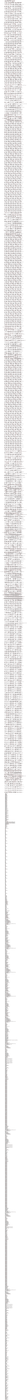
[diagram p0: schematic 1969.asc, whole sheet]
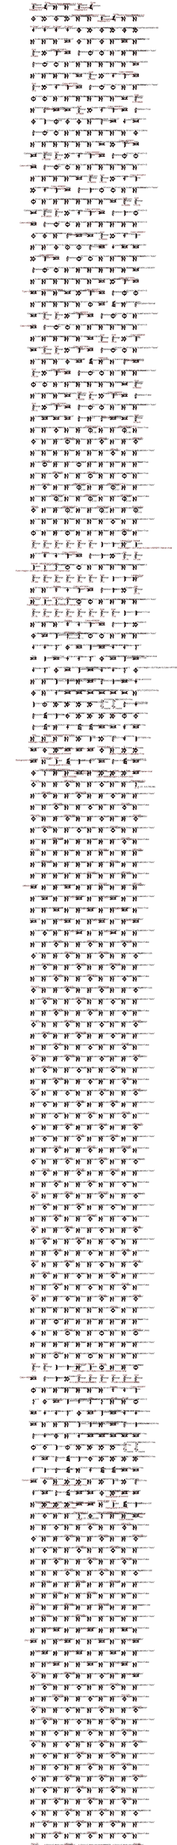
[diagram p1: schematic 1969.asc, part, row 1 of 5, column 1 of 1]
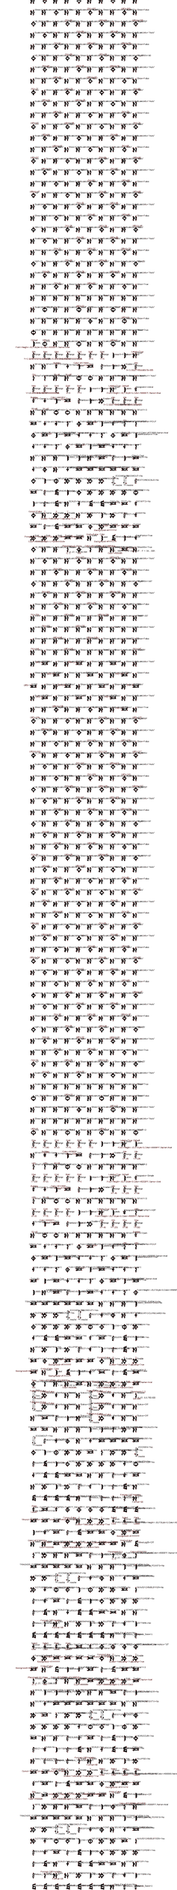
[diagram p2: schematic 1969.asc, part, row 2 of 5, column 1 of 1]
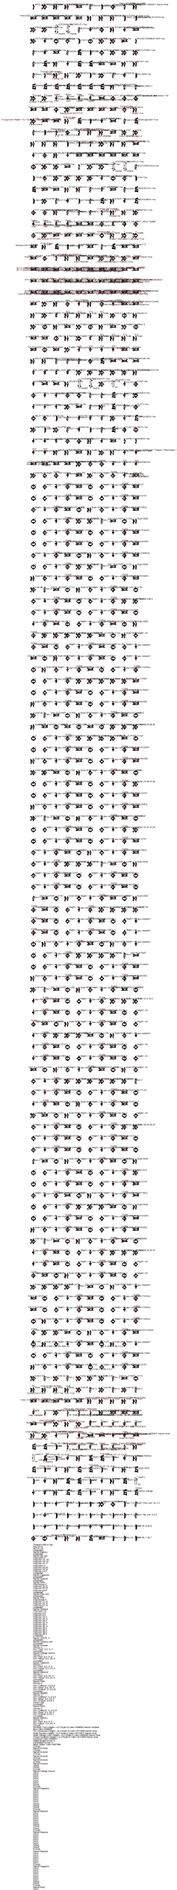
[diagram p3: schematic 1969.asc, part, row 3 of 5, column 1 of 1]
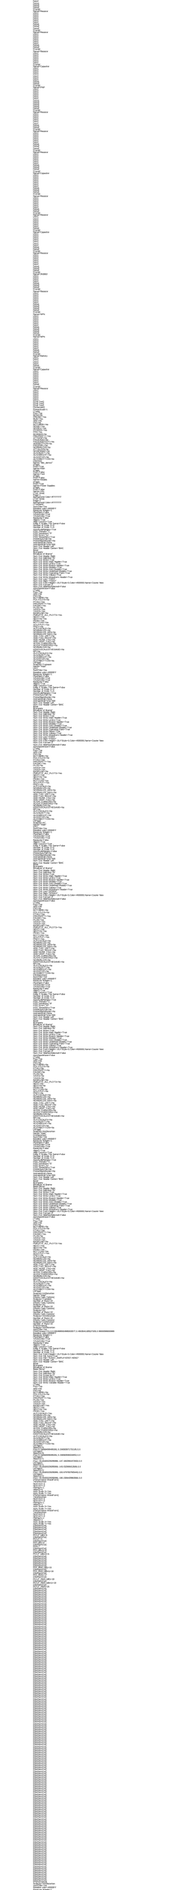
[diagram p4: schematic 1969.asc, part, row 4 of 5, column 1 of 1]
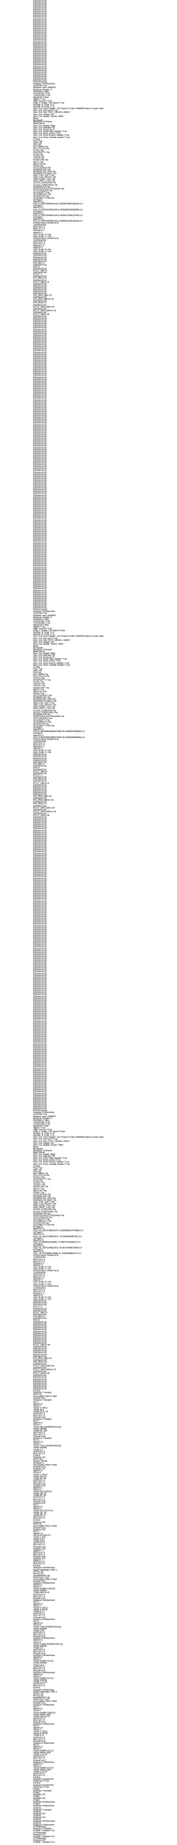
[diagram p5: schematic 1969.asc, part, row 5 of 5, column 1 of 1]
* 1969.asc
FileType=CIR 0 0
Version=10.01 0 0
Component Version=10.00 0
Shape Version=10.01 0 0 0
Screen=1920,1080 0 0 0 0
MCAPVersion=10.0.4.0 0 0 0 0
TXCnt=3 0 0 0 0
Line=0,0,22,0 0 0
Line=22,-3,22,3 0 0
Line=26,-7,26,7 0 0
Line=26,0,48,0 0 0
Current=32,8,16,8 0 0
Line=0,0,13,0 0 0
Rectangle=13,-12,15,12 0 0
Current=32,-24,32,-16 0 0
Current=32,24,32,16 0 0
Current=0,-8,8,-8 0 0
Line=0,0,22,0 0 0
Line=22,-8,22,8 0 0
Line=26,-8,26,8 0 0
Line=26,0,48,0 0 0
Current=32,12,16,12 0 0
Line=0,0,12,0 0 0
Line=12,-8,12,8 0 0
Line=18,-4,18,4 0 0
Line=24,0,24,0 0 0
Root="Bjt.root",0,0,0 0 0
Line=-2,0,2,0 0 0
Line=0,-2,0,2 0 0
Root="Bjt.root",0,0,0 0 0
Line=16,-4,14,-2 0 0
Line=16,4,14,2 0 0
Current=32,8,16,8 0 0
Root="Vsource.root",0,0,0 0 0
Line=0,0,12,0 0 0
Line=36,0,48,0 0 0
Ellipse=12,-12,36,12 0 0 0 0
FColor=None 0 0
Line=7,5,7,9 0 0
Root="Plus.root",41,7,0 0 0
Current=32,16,16,16 0 0
Definition=Ground 0 0
Shape=Ground 0 0 0 0
Mask=1793 0 0 0 0
memo=Ground 0 0 0 0
Label Offset=0,0,0,0 0
Definition=VSpice 0 0
Shape=SPICE_V 0 0 0 0
Mask=4864 0 0 0 0
memo=Voltage Source 0 0 0
Label Offset=19,13,15,13 0
Definition=Capacitor 0 0
Shape=Capacitor 0 0 0 0
Mask=6913 0 0 0 0
memo=Capacitor 0 0 0 0
Label Offset=16,12,12,12 0
Definition=Resistor 0 0
Shape=Resistor 0 0 0 0
Mask=7169 0 0 0 0
* Used=1: urc (symbol urc not available, pin order unknown); nets seen at it: 0
memo=Resistor 0 0 0 0
Label Offset=18,6,8,11 0
Definition=PNP 0 0
Shape=PNP 0 0 0 0
Mask=4609 0 0 0 0
memo=PNP Transistor 0 0 0
Label Offset=37,-13,-8,35 0
Definition=NPN 0 0
Shape=NPN 0 0 0 0
Mask=4224 0 0 0 0
* Used=3: urc (symbol urc not available, pin order unknown); nets seen at it: 0
memo=NPN High Voltage Transistor Transistor Ic=3.5A Pd=100W
Label Offset=29,-11,-6,26 0
Definition=NPN 0 0
Shape=NPN 0 0 0 0
Mask=4097 0 0 0 0
memo=NPN Transistor 0 0 0
Label Offset=37,-17,-14,33 0
Definition=Battery 0 0
Shape=Battery 0 0 0 0
Mask=4865 0 0 0 0
memo=Battery 0 0 0 0
Label Offset=19,7,10,13 0
Window Placement=2,3, -1,-1, -8,-30, 0,0,816,486
Default Object=Color=#000080 0
Default Object Font=Height=-15,FStyle=0,Color=#000080,Name=Arial
Default Object Apply Border To Text=No
Default Object Apply Fill To Text=No
WinBackGround Color=#FFFFFF 0
Select Color=#FF0000 0 0 0
Select Box Color=#000080 0 0
Grid Text Color=Height=-12,FStyle=0,Color=#FF0000,Name=Verdana 0 0
Component Color=#0000FF 0
Wire Color=#008000 0
Dynamic AC Voltage Color=#E4E4E4
Text Banner 0 Text=Height=-15,FStyle=0,Color=#800000,Name=Arial 0
Title Block 0 Background=#C0C0C0 0
Current=Height=-11,FStyle=0,Color=#0000FF,Name=Arial 0 0
Digital Path Color=#FF0000
Title Block=Height=-15,FStyle=0,Color=#000000,Name=Arial 0 0 0
Title Block 0 Border=#000000 0
Disabled Color=#C0C0C0 0
Error Color=#FF0000 0 0 0
Search Color=#FFFF00 0 0 0
Grid Color=#000000 0 0 0
Digital 0 Color=#000000
Digital R Color=#FFFF00
Digital F Color=#FFFF00
Digital 1 Color=#FF0000
Digital X Color=#C0C0C0
Digital Z Color=#808080
WarningFormat=3 0 0
GridTextFormulaFormat=3 0 0 0 0
Window Placement in AC Analysis=2,3, -1,-1, -8,-30, 75,75,1711,638
Window Placement in HmDistortion Analysis=1,2, 160,930, -4,-27, 793,465,1586,930
Window Placement in ImDistortion Analysis=1,2, 0,952, -4,-27, 0,0,816,486
SpiceType=AMBIGUOUS 0 0 0 0
TitleBlock Field_1=$name 0 0 0
TitleBlock Field_2=$user 0 $company 0
TitleBlock Field_3 0 0 0
TitleBlock Field_4=$date 0 0 0
TitleBlock Field_5=Page of $page $maxpage
TitleBlock One 0 Title=False 0
Title_Block_Border=False 0 0 0 0
Title_Block=False 0 0 0 0
Show Nodes=False 0 0 0
Show Voltages=False 0 0 0
Show Current=False 0 0 0
Show Power=False 0 0 0
Show Condition=False 0 0 0
Show Pin Connections=False 0 0
Show Cross=False 0 0 0
Show Attribute Text=True 0 0
Show Grid Text=True 0 0
Grid=26,11 0 0 0 0
Rot=1 0 0
Grid=86,12 0 0 0 0
Rot=1 0 0
Grid=90,57 0 0 0 0
Rot=1 0 0
Grid=2,54 0 0 0 0
Rot=1 0 0
Grid=31,68 0 0 0 0
Rot=1 0 0
Grids=2,42,7,42 0 0 0 0
Grids=2,42,2,44 0 0 0 0
Grid=2,50 0 0 0 0
Rot=3 0 0
ON=17,-4,PART 0 0 0 0
V=V1 0 0
Style=8192 0 0 0 0
Height=-16 0 0
Color=#0000FF 0 0
Font=Century Gothic 0
ON=-16,-41,VALUE 0 0 0 0
V=DC 0 AC 1 0 Sin 0 1 20k 0 0 0
Height=-16 0 0
Color=#0000FF 0 0
Font=Century Gothic 0
ON=0,22,COST 0 0 0 0
V 0 0
Height=-16 0 0
Color=#0000FF 0 0
Font=Century Gothic 0
ON=0,33,POWER 0 0 0 0
V 0 0
Height=-16 0 0
Color=#0000FF 0 0
Font=Century Gothic 0
ON=0,0,Saved_Pulse 0 0 0 0
V=DC 0 AC 1 0 Pulse 0 5 100n 10n 10n 400n 1u
Style=256 0 0 0 0
Height=-16 0 0
Color=#0000FF 0 0
Font=Century Gothic 0
ON=0,0,Saved_Sin 0 0 0 0
V=DC 0 AC 1 0 Sin 0 1 20k 0 0 0
Style=256 0 0 0 0
Height=-16 0 0
Color=#0000FF 0 0
Font=Century Gothic 0
Grids=2,50,2,54 0 0 0 0
Grid=7,42 0 0 0 0
ON=17,-34,PART 0 0 0 0
V=C1 0 0
Style=8192 0 0 0 0
Height=-16 0 0
Color=#0000FF 0 0
Font=Century Gothic 0
ON=10,12,CAPACITANCE 0 0 0 0
V=500n 0 0
Style=8192 0 0 0 0
Height=-16 0 0
Color=#0000FF 0 0
Font=Century Gothic 0
ON=0,22,CHARGE 0 0 0 0
V 0 0
Height=-16 0 0
Color=#0000FF 0 0
Font=Century Gothic 0
ON=0,33,FREQ 0 0 0 0
V 0 0
Height=-16 0 0
Color=#0000FF 0 0
Font=Century Gothic 0
ON=0,44,MODEL 0 0 0 0
V 0 0
Height=-16 0 0
Color=#0000FF 0 0
Font=Century Gothic 0
ON=0,55,COST 0 0 0 0
V 0 0
Height=-16 0 0
Color=#0000FF 0 0
Font=Century Gothic 0
ON=0,66,POWER 0 0 0 0
V 0 0
Height=-16 0 0
Color=#0000FF 0 0
Font=Century Gothic 0
Grids=13,42,18,42 0 0 0 0
Grids=18,5,18,20 0 0 0 0
Grids=18,5,26,5 0 0 0 0
Grid=18,20 0 0 0 0
Rot=7 0 0
ON=10,6,PART 0 0 0 0
V=R1 0 0
Style=8192 0 0 0 0
Height=-16 0 0
Color=#0000FF 0 0
Font=Century Gothic 0
ON=10,24,RESISTANCE 0 0 0 0
V=100K 0 0
Style=8192 0 0 0 0
Height=-16 0 0
Color=#0000FF 0 0
Font=Century Gothic 0
ON=0,22,FREQ 0 0 0 0
V 0 0
Height=-16 0 0
Color=#0000FF 0 0
Font=Century Gothic 0
ON=0,33,MODEL 0 0 0 0
V 0 0
Height=-16 0 0
Color=#0000FF 0 0
Font=Century Gothic 0
ON=0,44,COST 0 0 0 0
V 0 0
Height=-16 0 0
Color=#0000FF 0 0
Font=Century Gothic 0
ON=0,55,POWER 0 0 0 0
V 0 0
Height=-16 0 0
Color=#0000FF 0 0
Font=Century Gothic 0
Grids=18,26,18,42 0 0 0 0
Grids=18,42,18,54 0 0 0 0
Grids=18,42,20,42 0 0 0 0
Grid=18,54 0 0 0 0
Rot=7 0 0
ON=10,6,PART 0 0 0 0
V=R2 0 0
Style=8192 0 0 0 0
Height=-16 0 0
Color=#0000FF 0 0
Font=Century Gothic 0
ON=10,24,RESISTANCE 0 0 0 0
V=120000 0 0
Style=8192 0 0 0 0
Height=-16 0 0
Color=#0000FF 0 0
Font=Century Gothic 0
ON=0,22,FREQ 0 0 0 0
V 0 0
Height=-16 0 0
Color=#0000FF 0 0
Font=Century Gothic 0
ON=0,33,MODEL 0 0 0 0
V 0 0
Height=-16 0 0
Color=#0000FF 0 0
Font=Century Gothic 0
ON=0,44,COST 0 0 0 0
V 0 0
Height=-16 0 0
Color=#0000FF 0 0
Font=Century Gothic 0
ON=0,55,POWER 0 0 0 0
V 0 0
Height=-16 0 0
Color=#0000FF 0 0
Font=Century Gothic 0
Grids=18,60,18,68 0 0 0 0
Grids=18,68,31,68 0 0 0 0
Grid=20,42 0 0 0 0
ON=16,-29,PART 0 0 0 0
V=R3 0 0
Style=8192 0 0 0 0
Height=-16 0 0
Color=#0000FF 0 0
Font=Century Gothic 0
ON=16,10,RESISTANCE 0 0 0 0
V=2K2 0 0
Style=8192 0 0 0 0
Height=-16 0 0
Color=#0000FF 0 0
Font=Century Gothic 0
ON=16,22,FREQ 0 0 0 0
V 0 0
Height=-16 0 0
Color=#0000FF 0 0
Font=Century Gothic 0
ON=16,33,MODEL 0 0 0 0
V 0 0
Height=-16 0 0
Color=#0000FF 0 0
Font=Century Gothic 0
ON=16,44,COST 0 0 0 0
V 0 0
Height=-16 0 0
Color=#0000FF 0 0
Font=Century Gothic 0
ON=16,55,POWER 0 0 0 0
V 0 0
Height=-16 0 0
Color=#0000FF 0 0
Font=Century Gothic 0
Grid=26,5 0 0 0 0
Rot=1 0 0
ON=16,8,PART 0 0 0 0
V=C2 0 0
Style=8192 0 0 0 0
Height=-16 0 0
Color=#0000FF 0 0
Font=Century Gothic 0
ON=16,28,CAPACITANCE 0 0 0 0
V=100uF 0 0
Style=8192 0 0 0 0
Height=-16 0 0
Color=#0000FF 0 0
Font=Century Gothic 0
ON=16,22,CHARGE 0 0 0 0
V 0 0
Height=-16 0 0
Color=#0000FF 0 0
Font=Century Gothic 0
ON=16,33,FREQ 0 0 0 0
V 0 0
Height=-16 0 0
Color=#0000FF 0 0
Font=Century Gothic 0
ON=16,44,MODEL 0 0 0 0
V 0 0
Height=-16 0 0
Color=#0000FF 0 0
Font=Century Gothic 0
ON=16,55,COST 0 0 0 0
V 0 0
Height=-16 0 0
Color=#0000FF 0 0
Font=Century Gothic 0
ON=16,66,POWER 0 0 0 0
V 0 0
Height=-16 0 0
Color=#0000FF 0 0
Font=Century Gothic 0
Grids=26,5,34,5 0 0 0 0
Grids=26,42,28,42 0 0 0 0
Grid=28,42 0 0 0 0
ON=35,-21,PART 0 0 0 0
V=Q1 0 0
Style=8192 0 0 0 0
Height=-16 0 0
Color=#0000FF 0 0
Font=Century Gothic 0
ON=0,11,VALUE 0 0 0 0
V 0 0
Height=-16 0 0
Color=#0000FF 0 0
Font=Century Gothic 0
ON=28,1,MODEL 0 0 0 0
V=2N3906 0 0
Style=8192 0 0 0 0
Height=-16 0 0
Color=#0000FF 0 0
Font=Century Gothic 0
ON=0,33,COST 0 0 0 0
V 0 0
Height=-16 0 0
Color=#0000FF 0 0
Font=Century Gothic 0
ON=0,44,POWER 0 0 0 0
V 0 0
Height=-16 0 0
Color=#0000FF 0 0
Font=Century Gothic 0
ON=28,29,PACKAGE 0 0 0 0
V=TO-92 0 0
Height=-16 0 0
Color=#0000FF 0 0
Font=Century Gothic 0
Grids=31,37,31,39 0 0 0 0
Grids=31,37,47,37 0 0 0 0
Grids=31,45,31,48 0 0 0 0
Grids=31,48,63,48 0 0 0 0
Grids=31,48,31,54 0 0 0 0
Grid=31,54 0 0 0 0
Rot=7 0 0
ON=10,6,PART 0 0 0 0
V=R4 0 0
Style=8192 0 0 0 0
Height=-16 0 0
Color=#0000FF 0 0
Font=Century Gothic 0
ON=10,24,RESISTANCE 0 0 0 0
V=8K2 0 0
Style=8192 0 0 0 0
Height=-16 0 0
Color=#0000FF 0 0
Font=Century Gothic 0
ON=0,22,FREQ 0 0 0 0
V 0 0
Height=-16 0 0
Color=#0000FF 0 0
Font=Century Gothic 0
ON=0,33,MODEL 0 0 0 0
V 0 0
Height=-16 0 0
Color=#0000FF 0 0
Font=Century Gothic 0
ON=0,44,COST 0 0 0 0
V 0 0
Height=-16 0 0
Color=#0000FF 0 0
Font=Century Gothic 0
ON=0,55,POWER 0 0 0 0
V 0 0
Height=-16 0 0
Color=#0000FF 0 0
Font=Century Gothic 0
Grids=31,60,31,68 0 0 0 0
Grids=31,68,47,68 0 0 0 0
Grid=34,5 0 0 0 0
ON=16,-29,PART 0 0 0 0
V=R5 0 0
Style=8192 0 0 0 0
Height=-16 0 0
Color=#0000FF 0 0
Font=Century Gothic 0
ON=16,10,RESISTANCE 0 0 0 0
V=39K 0 0
Style=8192 0 0 0 0
Height=-16 0 0
Color=#0000FF 0 0
Font=Century Gothic 0
ON=16,22,FREQ 0 0 0 0
V 0 0
Height=-16 0 0
Color=#0000FF 0 0
Font=Century Gothic 0
ON=16,33,MODEL 0 0 0 0
V 0 0
Height=-16 0 0
Color=#0000FF 0 0
Font=Century Gothic 0
ON=16,44,COST 0 0 0 0
V 0 0
Height=-16 0 0
Color=#0000FF 0 0
Font=Century Gothic 0
ON=16,55,POWER 0 0 0 0
V 0 0
Height=-16 0 0
Color=#0000FF 0 0
Font=Century Gothic 0
Grids=40,5,47,5 0 0 0 0
Grids=47,5,47,9 0 0 0 0
Grids=47,5,76,5 0 0 0 0
Grid=47,9 0 0 0 0
Rot=7 0 0
ON=10,6,PART 0 0 0 0
V=R6 0 0
Style=8192 0 0 0 0
Height=-16 0 0
Color=#0000FF 0 0
Font=Century Gothic 0
ON=10,24,RESISTANCE 0 0 0 0
V=150 0 0
Style=8192 0 0 0 0
Height=-16 0 0
Color=#0000FF 0 0
Font=Century Gothic 0
ON=0,22,FREQ 0 0 0 0
V 0 0
Height=-16 0 0
Color=#0000FF 0 0
Font=Century Gothic 0
ON=0,33,MODEL 0 0 0 0
V 0 0
Height=-16 0 0
Color=#0000FF 0 0
Font=Century Gothic 0
ON=0,44,COST 0 0 0 0
V 0 0
Height=-16 0 0
Color=#0000FF 0 0
Font=Century Gothic 0
ON=0,55,POWER 0 0 0 0
V 0 0
Height=-16 0 0
Color=#0000FF 0 0
Font=Century Gothic 0
Grids=47,15,47,17 0 0 0 0
Grids=47,17,53,17 0 0 0 0
Grids=47,17,47,18 0 0 0 0
Grid=47,18 0 0 0 0
Rot=1 0 0
ON=16,8,PART 0 0 0 0
V=C3 0 0
Style=8192 0 0 0 0
Height=-16 0 0
Color=#0000FF 0 0
Font=Century Gothic 0
ON=16,28,CAPACITANCE 0 0 0 0
V=220uF 0 0
Style=8192 0 0 0 0
Height=-16 0 0
Color=#0000FF 0 0
Font=Century Gothic 0
ON=16,22,CHARGE 0 0 0 0
V 0 0
Height=-16 0 0
Color=#0000FF 0 0
Font=Century Gothic 0
ON=16,33,FREQ 0 0 0 0
V 0 0
Height=-16 0 0
Color=#0000FF 0 0
Font=Century Gothic 0
ON=16,44,MODEL 0 0 0 0
V 0 0
Height=-16 0 0
Color=#0000FF 0 0
Font=Century Gothic 0
ON=16,55,COST 0 0 0 0
V 0 0
Height=-16 0 0
Color=#0000FF 0 0
Font=Century Gothic 0
ON=16,66,POWER 0 0 0 0
V 0 0
Height=-16 0 0
Color=#0000FF 0 0
Font=Century Gothic 0
Grids=47,24,47,27 0 0 0 0
Grids=47,27,76,27 0 0 0 0
Grids=47,27,47,28 0 0 0 0
Grid=47,28 0 0 0 0
Rot=7 0 0
ON=10,6,PART 0 0 0 0
V=R7 0 0
Style=8192 0 0 0 0
Height=-16 0 0
Color=#0000FF 0 0
Font=Century Gothic 0
ON=10,24,RESISTANCE 0 0 0 0
V=2K7 0 0
Style=8192 0 0 0 0
Height=-16 0 0
Color=#0000FF 0 0
Font=Century Gothic 0
ON=0,22,FREQ 0 0 0 0
V 0 0
Height=-16 0 0
Color=#0000FF 0 0
Font=Century Gothic 0
ON=0,33,MODEL 0 0 0 0
V 0 0
Height=-16 0 0
Color=#0000FF 0 0
Font=Century Gothic 0
ON=0,44,COST 0 0 0 0
V 0 0
Height=-16 0 0
Color=#0000FF 0 0
Font=Century Gothic 0
ON=0,55,POWER 0 0 0 0
V 0 0
Height=-16 0 0
Color=#0000FF 0 0
Font=Century Gothic 0
Grids=47,34,47,37 0 0 0 0
Grids=47,37,47,41 0 0 0 0
Grid=47,41 0 0 0 0
Rot=7 0 0
ON=10,6,PART 0 0 0 0
V=R8 0 0
Style=8192 0 0 0 0
Height=-16 0 0
Color=#0000FF 0 0
Font=Century Gothic 0
ON=10,24,RESISTANCE 0 0 0 0
V=220 0 0
Style=8192 0 0 0 0
Height=-16 0 0
Color=#0000FF 0 0
Font=Century Gothic 0
ON=0,22,FREQ 0 0 0 0
V 0 0
Height=-16 0 0
Color=#0000FF 0 0
Font=Century Gothic 0
ON=0,33,MODEL 0 0 0 0
V 0 0
Height=-16 0 0
Color=#0000FF 0 0
Font=Century Gothic 0
ON=0,44,COST 0 0 0 0
V 0 0
Height=-16 0 0
Color=#0000FF 0 0
Font=Century Gothic 0
ON=0,55,POWER 0 0 0 0
V 0 0
Height=-16 0 0
Color=#0000FF 0 0
Font=Century Gothic 0
Grids=47,47,47,54 0 0 0 0
Grid=47,54 0 0 0 0
Rot=1 0 0
ON=16,8,PART 0 0 0 0
V=C4 0 0
Style=8192 0 0 0 0
Height=-16 0 0
Color=#0000FF 0 0
Font=Century Gothic 0
ON=16,28,CAPACITANCE 0 0 0 0
V=220uF 0 0
Style=8192 0 0 0 0
Height=-16 0 0
Color=#0000FF 0 0
Font=Century Gothic 0
ON=16,22,CHARGE 0 0 0 0
V 0 0
Height=-16 0 0
Color=#0000FF 0 0
Font=Century Gothic 0
ON=16,33,FREQ 0 0 0 0
V 0 0
Height=-16 0 0
Color=#0000FF 0 0
Font=Century Gothic 0
ON=16,44,MODEL 0 0 0 0
V 0 0
Height=-16 0 0
Color=#0000FF 0 0
Font=Century Gothic 0
ON=16,55,COST 0 0 0 0
V 0 0
Height=-16 0 0
Color=#0000FF 0 0
Font=Century Gothic 0
ON=16,66,POWER 0 0 0 0
V 0 0
Height=-16 0 0
Color=#0000FF 0 0
Font=Century Gothic 0
Grids=47,60,47,68 0 0 0 0
Grids=47,68,66,68 0 0 0 0
Grid=53,17 0 0 0 0
ON=16,-29,PART 0 0 0 0
V=R9 0 0
Style=8192 0 0 0 0
Height=-16 0 0
Color=#0000FF 0 0
Font=Century Gothic 0
ON=16,10,RESISTANCE 0 0 0 0
V=1K 0 0
Style=8192 0 0 0 0
Height=-16 0 0
Color=#0000FF 0 0
Font=Century Gothic 0
ON=16,22,FREQ 0 0 0 0
V 0 0
Height=-16 0 0
Color=#0000FF 0 0
Font=Century Gothic 0
ON=16,33,MODEL 0 0 0 0
V 0 0
Height=-16 0 0
Color=#0000FF 0 0
Font=Century Gothic 0
ON=16,44,COST 0 0 0 0
V 0 0
Height=-16 0 0
Color=#0000FF 0 0
Font=Century Gothic 0
ON=16,55,POWER 0 0 0 0
V 0 0
Height=-16 0 0
Color=#0000FF 0 0
Font=Century Gothic 0
Grids=59,17,66,17 0 0 0 0
Grids=66,17,66,45 0 0 0 0
Grids=66,17,73,17 0 0 0 0
Grid=63,48 0 0 0 0
ON=29,-11,PART 0 0 0 0
V=Q2 0 0
Style=8192 0 0 0 0
ON=29,3,MODEL 0 0 0 0
V=2N3902 0 0
ON=29,17,POWER 0 0 0 0
V=100 0 0
ON=29,45,PACKAGE 0 0 0 0
V=TO-204AA 0 0
Grids=66,51,66,56 0 0 0 0
Grids=66,56,73,56 0 0 0 0
Grids=66,56,66,59 0 0 0 0
Grid=66,59 0 0 0 0
Rot=7 0 0
ON=10,6,PART 0 0 0 0
V=R10 0 0
Style=8192 0 0 0 0
Height=-16 0 0
Color=#0000FF 0 0
Font=Century Gothic 0
ON=10,24,RESISTANCE 0 0 0 0
V=2K2 0 0
Style=8192 0 0 0 0
Height=-16 0 0
Color=#0000FF 0 0
Font=Century Gothic 0
ON=0,22,FREQ 0 0 0 0
V 0 0
Height=-16 0 0
Color=#0000FF 0 0
Font=Century Gothic 0
ON=0,33,MODEL 0 0 0 0
V 0 0
Height=-16 0 0
Color=#0000FF 0 0
Font=Century Gothic 0
ON=0,44,COST 0 0 0 0
V 0 0
Height=-16 0 0
Color=#0000FF 0 0
Font=Century Gothic 0
ON=0,55,POWER 0 0 0 0
V 0 0
Height=-16 0 0
Color=#0000FF 0 0
Font=Century Gothic 0
Grids=66,65,66,68 0 0 0 0
Grids=66,68,76,68 0 0 0 0
Grids=76,5,76,14 0 0 0 0
Grids=76,5,86,5 0 0 0 0
Grid=73,17 0 0 0 0
ON=32,-17,PART 0 0 0 0
V=Q3 0 0
Style=8192 0 0 0 0
Height=-16 0 0
Color=#0000FF 0 0
Font=Century Gothic 0
ON=32,11,VALUE 0 0 0 0
V 0 0
Height=-16 0 0
Color=#0000FF 0 0
Font=Century Gothic 0
ON=32,1,MODEL 0 0 0 0
V=MJE480 0 0
Style=8192 0 0 0 0
Height=-16 0 0
Color=#0000FF 0 0
Font=Century Gothic 0
ON=32,33,COST 0 0 0 0
V 0 0
Height=-16 0 0
Color=#0000FF 0 0
Font=Century Gothic 0
ON=32,44,POWER 0 0 0 0
V 0 0
Height=-16 0 0
Color=#0000FF 0 0
Font=Century Gothic 0
ON=32,29,PACKAGE 0 0 0 0
V=TO-39 0 0
Height=-16 0 0
Color=#0000FF 0 0
Font=Century Gothic 0
Grids=76,20,76,27 0 0 0 0
Grids=76,27,76,41 0 0 0 0
Grids=76,41,90,41 0 0 0 0
Grids=76,41,76,53 0 0 0 0
Grid=73,56 0 0 0 0
ON=32,-17,PART 0 0 0 0
V=Q4 0 0
Style=8192 0 0 0 0
Height=-16 0 0
Color=#0000FF 0 0
Font=Century Gothic 0
ON=32,11,VALUE 0 0 0 0
V 0 0
Height=-16 0 0
Color=#0000FF 0 0
Font=Century Gothic 0
ON=32,1,MODEL 0 0 0 0
V=MJE480 0 0
Style=8192 0 0 0 0
Height=-16 0 0
Color=#0000FF 0 0
Font=Century Gothic 0
ON=32,33,COST 0 0 0 0
V 0 0
Height=-16 0 0
Color=#0000FF 0 0
Font=Century Gothic 0
ON=32,44,POWER 0 0 0 0
V 0 0
Height=-16 0 0
Color=#0000FF 0 0
Font=Century Gothic 0
ON=32,29,PACKAGE 0 0 0 0
V=TO-39 0 0
Height=-16 0 0
Color=#0000FF 0 0
Font=Century Gothic 0
Grids=76,59,76,68 0 0 0 0
Grids=86,5,86,6 0 0 0 0
Grid=86,12 0 0 0 0
Rot=3 0 0
ON=6,-48,PART 0 0 0 0
V=V2 0 0
Style=8192 0 0 0 0
Height=-16 0 0
Color=#0000FF 0 0
Font=Century Gothic 0
ON=9,-21,VALUE 0 0 0 0
V=50 0 0
Style=8192 0 0 0 0
Height=-16 0 0
Color=#0000FF 0 0
Font=Century Gothic 0
ON=0,22,COST 0 0 0 0
V 0 0
Height=-16 0 0
Color=#0000FF 0 0
Font=Century Gothic 0
ON=0,33,POWER 0 0 0 0
V 0 0
Height=-16 0 0
Color=#0000FF 0 0
Font=Century Gothic 0
Grids=90,41,90,42 0 0 0 0
Grid=90,42 0 0 0 0
Rot=7 0 0
ON=-38,8,PART 0 0 0 0
V=C5 0 0
Style=8192 0 0 0 0
Height=-16 0 0
Color=#0000FF 0 0
Font=Century Gothic 0
ON=-61,28,CAPACITANCE 0 0 0 0
V=2200uF 0 0
Style=8192 0 0 0 0
Height=-16 0 0
Color=#0000FF 0 0
Font=Century Gothic 0
ON=-16,22,CHARGE 0 0 0 0
V 0 0
Height=-16 0 0
Color=#0000FF 0 0
Font=Century Gothic 0
ON=-16,33,FREQ 0 0 0 0
V 0 0
Height=-16 0 0
Color=#0000FF 0 0
Font=Century Gothic 0
ON=-16,44,MODEL 0 0 0 0
V 0 0
Height=-16 0 0
Color=#0000FF 0 0
Font=Century Gothic 0
ON=-16,55,COST 0 0 0 0
V 0 0
Height=-16 0 0
Color=#0000FF 0 0
Font=Century Gothic 0
ON=-16,66,POWER 0 0 0 0
V 0 0
Height=-16 0 0
Color=#0000FF 0 0
Font=Century Gothic 0
Grids=90,48,90,51 0 0 0 0
Grid=90,51 0 0 0 0
Rot=7 0 0
ON=10,6,PART 0 0 0 0
V=R11 0 0
Style=8192 0 0 0 0
Height=-16 0 0
Color=#0000FF 0 0
Font=Century Gothic 0
ON=10,24,RESISTANCE 0 0 0 0
V=8 0 0
Style=8192 0 0 0 0
Height=-16 0 0
Color=#0000FF 0 0
Font=Century Gothic 0
ON=0,22,FREQ 0 0 0 0
V 0 0
Height=-16 0 0
Color=#0000FF 0 0
Font=Century Gothic 0
ON=0,33,MODEL 0 0 0 0
V 0 0
Height=-16 0 0
Color=#0000FF 0 0
Font=Century Gothic 0
ON=0,44,COST 0 0 0 0
V 0 0
Height=-16 0 0
Color=#0000FF 0 0
Font=Century Gothic 0
ON=0,55,POWER 0 0 0 0
V 0 0
Height=-16 0 0
Color=#0000FF 0 0
Font=Century Gothic 0
Text="OUT" 0 0 0 0
Grid=90,41 0 0 0 0
Height=-16 0 0
Font=Century Gothic 0
CBorder=None 0 0
Text="IN" 0 0 0 0
Grid=2,42 0 0 0 0
Height=-16 0 0
Font=Century Gothic 0
CBorder=None 0 0
Text="10 Watt A Class Power Amplifier circa 1965?"
Text="by John Hood" Linsley 0
Text=".13% THD 1KHz at and 10 watts"
Text="http://www.hilberink.nl/amps/amps.htm" 0 0 0 0
Text="http://www.tcaas.btinternet.co.uk/jlh1969.pdf" 0 0 0 0
Grid=79,37 0 0 0 0
Height=-16 0 0
Font=Century Gothic 0
CBorder=None 0 0
CurrentSection 0=0 0
CurrentSection 1=0 0
CurrentSection 2=0 0
CurrentSection 3=0 0
Splitter.xs=0 0 0 0 0
Splitter.ys=0 0 0 0 0
TextQuad=4099 0 0 0 0
Scale=1 0 0 0 0
GridUser=10 0 0 0 0
ShapeGroups="Main","Euro","DeMorgan","Polarity","Electrolytic","GroundArrow" 0 0 0 0
CalcRMS=False 0 0
CalcAVG=False 0 0
CalcPeak=False 0 0
CalcVoltage=True 0 0
DisplayMeasure=Last 0 0
FILESAVEASOLD=No 0 0
FILEPCB=No 0 0
SELECT=Yes 0 0 0 0
COMP=Yes 0 0
TEXT=Yes 0 0 0 0
WIRE=Yes 0 0
WIRED=Yes 0 0
GRAPHIC=Yes 0 0 0 0
LINE=No 0 0
ELLIPSE=No 0 0 0 0
RECT=No 0 0
DIAM=No 0 0
LEFTBRK=No 0 0
RIGHTBRK=No 0 0
META=No 0 0 0 0
FLAG=No 0 0
INFO=Yes 0 0
HELP=Yes 0 0
HELP_SPICE=No 0 0
LINK=No 0 0
REGION_ENABLE=Yes 0 0
DIGTRC=No 0 0
DIGTRC2=No 0 0
DIGALL=No 0 0
GRIDTEXT=Yes 0 0 0 0
COMPTEXT=Yes 0 0
MEASURED=Yes 0 0 0 0
CURRENT=Yes 0 0
CONDITIN=Yes 0 0
CROSS=No 0 0
GRID=No 0 0 0 0
TITLE=No 0 0 0 0
RUBBER=Yes 0 0
STEP=Yes 0 0 0 0
MIRROR=Yes 0 0 0 0
ROTATE=Yes 0 0
FLIPY=Yes 0 0
FLIPX=Yes 0 0
CIR_MAKEMACRO=No 0 0
CLEARCUTWIRE=No 0 0
FINDCOMP=Yes 0 0
FIND=Yes 0 0
REPEAT=No 0 0
REPLACE=No 0 0
MODEL=Yes 0 0 0 0
CIR2CKT=No 0 0
ENABLE=No 0 0 0 0
DISABLE=No 0 0
TOFRONT=No 0 0 0 0
TOBACK=No 0 0 0 0
SELNEXT=No 0 0 0 0
* ZOOMIN=Yes: mesfet (symbol mesfet not available, pin order unknown); nets seen at it: 0
* ZOOMOUT=Yes: mesfet (symbol mesfet not available, pin order unknown); nets seen at it: 0
GOTOFLAG=No 0 0 0 0
* UPLEVEL=Yes: urc (symbol urc not available, pin order unknown); nets seen at it: 0
COLOR=No 0 0
FONT=No 0 0
DM_LAST=No 0 0
DM_RMS=No 0 0
DM_AVG=No 0 0
DM_PEAK=No 0 0
GRID_NONE=No 0 0 0 0
GRID_NORMAL=No 0 0 0 0
GRID_BOLD_5=No 0 0 0 0
GRID_BOLD_6=No 0 0 0 0
GRID_BOLD_USER=No 0 0 0 0
SPLITCIRTEXTH=No 0 0 0 0
SPLITCIRTEXTV=No 0 0 0 0
SPACE_SPLITTERS_EVENLY=No 0 0 0 0
RENAMEDEFINE=No 0 0
RENAMECMP=No 0 0
RESETNODEPOS=No 0 0
FIT2STANDARD=No 0 0
MOVETEXT=No 0 0 0 0
TEXTINC=No 0 0 0 0
TOGGLETEXT=No 0 0 0 0
TOGGLEMODE=No 0 0 0 0
TOLERANCE=No 0 0 0 0
Index=0 0 0
Type=Main 0 0 0 0
Enable=True 0 0 0 0
CurrentPage 0=0 0
CurrentPage 1=0 0
CurrentPage 2=0 0
CurrentPage 3=0 0
TabSize 0=400 0 0 0
TabSize 1=400 0 0 0
TabSize 2=400 0 0 0
TabSize 3=400 0 0 0
Index=0 0 0
Section=0 0 0 0 0
Enable=True 0 0 0 0
DIST.PrintPreview=Off,0,0,1,1 0 0
Scale 0=1 0 0 0
Scale 1=1 0 0 0
Scale 2=1 0 0 0
Scale 3=1 0 0 0
Grid=111,51 0 0 0 0
Index=1 0 0
Section=0 0 0 0 0
Type=Text 0 0 0 0
Enable=True 0 0 0 0
Index=2 0 0
Section=0 0 0 0 0
Type=Text 0 0 0 0
Enable=True 0 0 0 0
Index=3 0 0
Section=0 0 0 0 0
Enable=True 0 0 0 0
DIST.PrintPreview=Off,0,0,1,1 0 0
Scale 0=1 0 0 0
Scale 1=1 0 0 0
Scale 2=1 0 0 0
Scale 3=1 0 0 0
Grid=1,1 0 0 0 0
Index=4 0 0
Section=0 0 0 0 0
Type=Info 0 0 0 0
Enable=True 0 0 0 0
Section=0 0 0 0 0
Font=Height=-15,FStyle=0,Color=#000000,Name=Courier New 0
Comment Color=#008000 0
Section=0 0 0 0 0
Font=Height=-15,FStyle=0,Color=#000000,Name=Courier New 0
Comment Color=#008000 0
Text=*** From C:\MC10W\library\MSBJT.LBR file 0
Text=*** PNP noise Low transistors
Text=.MODEL BC560C (BF=200 PNP BR=5 CJC=5.58666P CJE=6.98502P IKF=507.201M
Text=+ IKR=990.691 ISC=10.4045F IS=6.03227P ISE=30.8495P ITF=10.1011M MJC=499.603M
Text=+ MJE=334.817M NF=1.33997 NE=3 TF=495.739P TR=10N VAF=100 VJC=749.978M VJE=700M
Text=+ VTF=10 0 XTF=500.033M) 0
Text=*** From C:\MC10W\library\MPBJT.LBR file 0
Text=*** NPN 80V 1.5A 0
Text=.MODEL BD139 (BF=200 NPN BR=99.671345772217M CJC=5P CJE=2P
Text=+ IKF=559.818760296133M IS=9.999956070726F IKR=999.999675660315M 0
Text=+ ISC=404.194992780472F ITF=10M ISE=972.249942004551F MJC=500M MJE=500M
Text=+ NC=2.000000001175 NF=1.001625491959 NE=1.562677837831 TF=1N TR=10N VAF=100
Text=+ VTF=10 0 XTF=500M) 0
Text=.MODEL SS (CJO=1P) D 0
Text=.MODEL NN (BF=5000) NPN 0
Text=*** From C:\MC10W\library\SKYWORKS.LIB file 0
Text=.MODEL SMS7630 (BV=1e4 D CJO=.14P EG=.69 FC=.5 IBV=1N IS=1e-18 M=.4 N=1.05 NR=1 TT=1E-11 VJ=.34 XTI=2)
Text=*** From C:\MC10W\library\MPBJT.LBR file 0
Text=*** PNP 80V 1.5A 0
Text=.MODEL BD140 (BF=500 PNP BR=99.671345772217M CJC=5p CJE=2p
Text=+ IKF=559.818760296133M IS=9.999956070726F IKR=999.999675660315M 0
Text=+ ISC=404.194992780472F ITF=10M ISE=972.249942004551F MJC=500M MJE=500m
Text=+ NC=2.000000001175 NF=1.001625491959 NE=1.562677837831 RC=309.205194321893m
Text=+ RE=365.688938169078m TR=10n TF=1N VAF=100 VTF=10 XTF=500m)
Text=*** From C:\MC10W\library\MSBJT.LBR file 0
Text=*** NPN noise Low transistors
Text=.MODEL BC549 (BF=437.778 NPN BR=3.12472 CJC=3.95759p CJE=6.98126p IKF=540.655m
Text=+ IKR=18.5707m ISC=56.5841f IS=10.033f ISE=.000000121848f ITF=9.95056m MJC=300m
Text=+ MJE=334.494m NF=1.01548 NE=2.99723 RC=554.461m RE=2 TF=505.102p TR=10n
Text=+ VAF=100 VJE=700m VJC=723.124m VTF=10 XTF=499.996m)
Text=.MODEL BC549 () PNP 0
Text=.MODEL 2N3055 () NPN 0
Text=.MODEL MJE480 () NPN 0
Font=Height=-15,FStyle=0,Color=#0000FF,Name=Arial 0 0
WinBackGround Color=#FFFFFF 0
Select Color=#FF0000 0 0 0
Select Box Color=#000080 0 0
Title=AUDIO_AMPLIFIER27.CIR 0 0 0 0
Grid Color=#808080 0 0 0
Grid Weight=1 0 0 0
Grid Pattern=Dot6 0 0 0
Tracker Foreground=Height=-15,FStyle=0,Color=#000000,Name=Arial 0 0 0
Tracker Background=#FFFF00 0 0 0
Static Grids=False 0 0 0
MinorLog25=Off 0 0 0 0
LabelMinor=Off 0 0
DataPoints=False 0 0
Token=False 0 0 0 0
Ruler=False 0 0
MinorLogGrids=True 0 0 0 0
TagFormatX=3 0 0 0 0
TagFormatY=3 0 0 0 0
FormulaFormat=3 0 0
Graph Background=#FFFFFF 0 0 0
Tracker Intercept=False 0 0 0
Tracker Mouse=True 0 0 0
Tracker Cursor=True 0 0 0
Tracker Cursor 0 BranchInfo=False 0
Horizontal Cursor=False 0
Same Y Scales=Yes 0 0
Enable X Scaling=True 0 0
Enable Y Scaling=True 0 0
Cursor Select Color Primary=#C0C0C0
Cursor Select Color Secondary=#FF0000
Data Point Labels Color Fore=Height=-15,FStyle=0,Color=#000000,Name=Arial
Data Point Labels Color Back=#FFFF00
OperPoint=True 0 0 0 0
OperPointOnly=False 0 0 0 0
FixedTimeStep=False 0 0
DoPSS=True 0 0
FFT_Min="0" 0 0
FFT_NPts="16384" 0 0
FFT_IncludeDCHarmonic=True 0 0
FFT_AutoScale_Harmonics="10" 0 0
Save_For_Future=No 0 0 0 0
Reduce_Display=1 0 0
Reduce_Save=1 0 0
Reduce_ThrowDataOut=0 0 0
Wave Format=16E 0
State Variables Format=5E 0 0
SELECT=Yes 0 0 0 0
GRAPHIC=Yes 0 0 0 0
LINE=No 0 0
ELLIPSE=No 0 0 0 0
RECT=No 0 0
DIAM=No 0 0
LEFTBRK=No 0 0
RIGHTBRK=No 0 0
META=No 0 0 0 0
SCALE=Yes 0 0 0 0
CURSOR=Yes 0 0
MEASUREH=Yes 0 0 0 0
MEASUREV=Yes 0 0 0 0
TAG=Yes 0 0 0 0
TEXT=Yes 0 0 0 0
START=Yes 0 0 0 0
STOP=Yes 0 0 0 0
RESUME=No 0 0
DATAPTS=Yes 0 0
TOKENS=Yes 0 0 0 0
RULER=No 0 0
MINORLOG=Yes 0 0 0 0
LOG25=No 0 0
HORIZCUR=No 0 0
GOTOX=Yes 0 0 0 0
GOTOY=Yes 0 0 0 0
GOTOPERF=Yes 0 0 0 0
GOTOBRNC=Yes 0 0 0 0
CLEAR_ACCUMULATED=Yes 0 0
VALLEY=Yes 0 0
HIGH=Yes 0 0
LOW=Yes 0 0
INFLECTN=Yes 0 0
GHIGH=Yes 0 0 0 0
GLOW=Yes 0 0 0 0
TOP=Yes 0 0 0 0
WAVEFORMBUFFER=Yes 0 0
ENXSCALE=Yes 0 0 0 0
ENYSCALE=Yes 0 0 0 0
* ZOOMIN=Yes: mesfet (symbol mesfet not available, pin order unknown); nets seen at it: 0
* ZOOMOUT=Yes: mesfet (symbol mesfet not available, pin order unknown); nets seen at it: 0
RESTORESCALE=No 0 0
COLOR=No 0 0
FONT=No 0 0
SELNEXT=No 0 0 0 0
CURSORTOCLIPBOARD=No 0 0
TRACKER_CURSOR=No 0 0 0 0
TRACKER_CURSOR_BRANCHINFO=No 0 0 0 0
TRACKER_INTERCEPT=No 0 0 0 0
TRACKER_MOUSE=No 0 0 0 0
TOFRONT=Yes 0 0 0 0
TOBACK=Yes 0 0 0 0
SPLITCIRTEXTH=No 0 0 0 0
SPLITCIRTEXTV=No 0 0 0 0
SPACE_SPLITTERS_EVENLY=No 0 0 0 0
LABEL_WAVEFORM=No 0 0
LABEL_DATA_POINTS=No 0 0
WFB_ADD_TO_LIMITS=No 0 0
ENVELOPE=No 0 0 0 0
SAMEYSCALES=No 0 0 0 0
SHOWWATCH=No 0 0 0 0
TOGGLEMODE=No 0 0 0 0
REMOVEALLTEXT=No 0 0
LABELALLMINOR=No 0 0
Window Placement=2,3, -1,-1, -8,-30, 75,75,1711,638
Font=Height=-15,FStyle=0,Color=#0000FF,Name=Arial 0 0
WinBackGround Color=#FFFFFF 0
Select Color=#FF0000 0 0 0
Select Box Color=#000080 0 0
Title 0 0 0 0
Grid Color=#808080 0 0 0
Grid Weight=1 0 0 0
Grid Pattern=Dot6 0 0 0
Tracker Foreground=Height=-15,FStyle=0,Color=#000000,Name=Arial 0 0 0
Tracker Background=#FFFF00 0 0 0
Static Grids=False 0 0 0
MinorLog25=Off 0 0 0 0
LabelMinor=Off 0 0
DataPoints=False 0 0
Token=False 0 0 0 0
Ruler=False 0 0
MinorLogGrids=True 0 0 0 0
TagFormatX=3 0 0 0 0
TagFormatY=3 0 0 0 0
FormulaFormat=3 0 0
Graph Background=#FFFFFF 0 0 0
Tracker Intercept=False 0 0 0
Tracker Mouse=True 0 0 0
Tracker Cursor=True 0 0 0
Tracker Cursor 0 BranchInfo=False 0
Horizontal Cursor=False 0
Same Y Scales=Yes 0 0
Enable X Scaling=True 0 0
Enable Y Scaling=True 0 0
Cursor Select Color Primary=#C0C0C0
Cursor Select Color Secondary=#FF0000
Data Point Labels Color Fore=Height=-15,FStyle=0,Color=#000000,Name=Arial
Data Point Labels Color Back=#FFFF00
OperPoint=True 0 0 0 0
FFT_NPts="1024" 0 0
FFT_IncludeDCHarmonic=False 0 0
FFT_AutoScale_Harmonics="10" 0 0
MonMaxShow=3 0 0 0 0
MonPageWidth=66 0 0 0 0
MonPlotWidth=21 0 0 0 0
MonExprXWidth=142 0 0 0 0
MonExprYWidth=260 0 0 0 0
MonRangeXWidth=90 0 0 0 0
MonRangeYWidth=90 0 0 0 0
Save_For_Future=No 0 0 0 0
Reduce_Display=1 0 0
Reduce_Save=1 0 0
Reduce_ThrowDataOut=0 0 0
Wave Format=16E 0
State Variables Format=5E 0 0
SELECT=Yes 0 0 0 0
GRAPHIC=Yes 0 0 0 0
LINE=No 0 0
ELLIPSE=No 0 0 0 0
RECT=No 0 0
DIAM=No 0 0
LEFTBRK=No 0 0
RIGHTBRK=No 0 0
META=No 0 0 0 0
SCALE=Yes 0 0 0 0
CURSOR=Yes 0 0
MEASUREH=Yes 0 0 0 0
MEASUREV=Yes 0 0 0 0
TAG=Yes 0 0 0 0
TEXT=Yes 0 0 0 0
START=Yes 0 0 0 0
STOP=Yes 0 0 0 0
RESUME=No 0 0
DATAPTS=Yes 0 0
TOKENS=Yes 0 0 0 0
RULER=No 0 0
MINORLOG=Yes 0 0 0 0
LOG25=No 0 0
HORIZCUR=No 0 0
GOTOX=Yes 0 0 0 0
GOTOY=Yes 0 0 0 0
GOTOPERF=Yes 0 0 0 0
GOTOBRNC=Yes 0 0 0 0
CLEAR_ACCUMULATED=Yes 0 0
VALLEY=Yes 0 0
HIGH=Yes 0 0
LOW=Yes 0 0
INFLECTN=Yes 0 0
GHIGH=Yes 0 0 0 0
GLOW=Yes 0 0 0 0
TOP=Yes 0 0 0 0
WAVEFORMBUFFER=Yes 0 0
ENXSCALE=Yes 0 0 0 0
ENYSCALE=Yes 0 0 0 0
* ZOOMIN=Yes: mesfet (symbol mesfet not available, pin order unknown); nets seen at it: 0
* ZOOMOUT=Yes: mesfet (symbol mesfet not available, pin order unknown); nets seen at it: 0
RESTORESCALE=No 0 0
COLOR=No 0 0
FONT=No 0 0
SELNEXT=No 0 0 0 0
CURSORTOCLIPBOARD=No 0 0
TRACKER_CURSOR=No 0 0 0 0
TRACKER_CURSOR_BRANCHINFO=No 0 0 0 0
TRACKER_INTERCEPT=No 0 0 0 0
TRACKER_MOUSE=No 0 0 0 0
TOFRONT=Yes 0 0 0 0
TOBACK=Yes 0 0 0 0
SPLITCIRTEXTH=No 0 0 0 0
SPLITCIRTEXTV=No 0 0 0 0
SPACE_SPLITTERS_EVENLY=No 0 0 0 0
LABEL_WAVEFORM=No 0 0
LABEL_DATA_POINTS=No 0 0
WFB_ADD_TO_LIMITS=No 0 0
ENVELOPE=No 0 0 0 0
SAMEYSCALES=No 0 0 0 0
SHOWWATCH=No 0 0 0 0
TOGGLEMODE=No 0 0 0 0
REMOVEALLTEXT=No 0 0
LABELALLMINOR=No 0 0
Font=Height=-15,FStyle=0,Color=#0000FF,Name=Arial 0 0
WinBackGround Color=#FFFFFF 0
Select Color=#FF0000 0 0 0
Select Box Color=#000080 0 0
Title 0 0 0 0
Grid Color=#808080 0 0 0
Grid Weight=1 0 0 0
Grid Pattern=Dot6 0 0 0
Tracker Foreground=Height=-15,FStyle=0,Color=#000000,Name=Arial 0 0 0
Tracker Background=#FFFF00 0 0 0
Static Grids=False 0 0 0
MinorLog25=Off 0 0 0 0
LabelMinor=Off 0 0
DataPoints=False 0 0
Token=False 0 0 0 0
Ruler=False 0 0
MinorLogGrids=True 0 0 0 0
TagFormatX=3 0 0 0 0
TagFormatY=3 0 0 0 0
FormulaFormat=3 0 0
Graph Background=#FFFFFF 0 0 0
Tracker Intercept=False 0 0 0
Tracker Mouse=True 0 0 0
Tracker Cursor=True 0 0 0
Tracker Cursor 0 BranchInfo=False 0
Horizontal Cursor=False 0
Same Y Scales=Yes 0 0
Enable X Scaling=True 0 0
Enable Y Scaling=True 0 0
Cursor Select Color Primary=#C0C0C0
Cursor Select Color Secondary=#FF0000
Data Point Labels Color Fore=Height=-15,FStyle=0,Color=#000000,Name=Arial
Data Point Labels Color Back=#FFFF00
Save_For_Future=No 0 0 0 0
Reduce_Display=1 0 0
Reduce_Save=1 0 0
Reduce_ThrowDataOut=0 0 0
Wave Format=16E 0
State Variables Format=5E 0 0
SELECT=Yes 0 0 0 0
GRAPHIC=Yes 0 0 0 0
LINE=No 0 0
ELLIPSE=No 0 0 0 0
RECT=No 0 0
DIAM=No 0 0
LEFTBRK=No 0 0
RIGHTBRK=No 0 0
META=No 0 0 0 0
SCALE=Yes 0 0 0 0
CURSOR=Yes 0 0
MEASUREH=Yes 0 0 0 0
MEASUREV=Yes 0 0 0 0
TAG=Yes 0 0 0 0
TEXT=Yes 0 0 0 0
START=Yes 0 0 0 0
STOP=Yes 0 0 0 0
RESUME=No 0 0
DATAPTS=Yes 0 0
TOKENS=Yes 0 0 0 0
RULER=Yes 0 0
MINORLOG=Yes 0 0 0 0
LOG25=Yes 0 0
HORIZCUR=Yes 0 0
GOTOX=Yes 0 0 0 0
GOTOY=Yes 0 0 0 0
GOTOPERF=Yes 0 0 0 0
GOTOBRNC=Yes 0 0 0 0
CLEAR_ACCUMULATED=Yes 0 0
VALLEY=Yes 0 0
HIGH=Yes 0 0
LOW=Yes 0 0
INFLECTN=Yes 0 0
GHIGH=Yes 0 0 0 0
GLOW=Yes 0 0 0 0
TOP=Yes 0 0 0 0
WAVEFORMBUFFER=Yes 0 0
ENXSCALE=Yes 0 0 0 0
ENYSCALE=Yes 0 0 0 0
* ZOOMIN=Yes: mesfet (symbol mesfet not available, pin order unknown); nets seen at it: 0
* ZOOMOUT=Yes: mesfet (symbol mesfet not available, pin order unknown); nets seen at it: 0
RESTORESCALE=No 0 0
COLOR=Yes 0 0
FONT=Yes 0 0
SELNEXT=No 0 0 0 0
CURSORTOCLIPBOARD=No 0 0
TRACKER_CURSOR=No 0 0 0 0
TRACKER_CURSOR_BRANCHINFO=No 0 0 0 0
TRACKER_INTERCEPT=No 0 0 0 0
TRACKER_MOUSE=No 0 0 0 0
TOFRONT=Yes 0 0 0 0
TOBACK=Yes 0 0 0 0
SPLITCIRTEXTH=No 0 0 0 0
SPLITCIRTEXTV=No 0 0 0 0
SPACE_SPLITTERS_EVENLY=No 0 0 0 0
LABEL_WAVEFORM=No 0 0
LABEL_DATA_POINTS=No 0 0
WFB_ADD_TO_LIMITS=No 0 0
ENVELOPE=No 0 0 0 0
SAMEYSCALES=No 0 0 0 0
SHOWWATCH=No 0 0 0 0
TOGGLEMODE=No 0 0 0 0
REMOVEALLTEXT=No 0 0
LABELALLMINOR=No 0 0
Window Placement=0,1, -1,-1, -4,-27, 793,0,1586,930
Font=Height=-18,FStyle=0,Color=#0000FF,Name=Comic Sans MS
WinBackGround Color=#FFFFFF 0
Select Color=#FF0000 0 0 0
Select Box Color=#000080 0 0
Title=DIST_DEMO1.CIR VIN=1m...400m 0 F=1k...50k 0
Grid Color=#808080 0 0 0
Grid Weight=1 0 0 0
Grid Pattern=Dot6 0 0 0
Tracker Foreground=Height=-15,FStyle=0,Color=#000000,Name=Arial 0 0 0
Tracker Background=#FFFF00 0 0 0
Static Grids=False 0 0 0
MinorLog25=Off 0 0 0 0
LabelMinor=Off 0 0
DataPoints=False 0 0
Token=False 0 0 0 0
Ruler=False 0 0
MinorLogGrids=False 0 0 0 0
TagFormatX=3 0 0 0 0
TagFormatY=3 0 0 0 0
FormulaFormat=3 0 0
Graph Background=#FFFFFF 0 0 0
Tracker Intercept=False 0 0 0
Tracker Mouse=True 0 0 0
Tracker Cursor=True 0 0 0
Tracker Cursor 0 BranchInfo=False 0
Horizontal Cursor=False 0
Same Y Scales=Yes 0 0
Enable X Scaling=True 0 0
Enable Y Scaling=True 0 0
Cursor Select Color Primary=#C0C0C0
Cursor Select Color Secondary=#FF0000
Data Point Labels Color Fore=Height=-15,FStyle=0,Color=#000000,Name=Arial
Data Point Labels Color Back=#FFFF00
OperPoint=True 0 0 0 0
DoPSS=True 0 0
FFT_Min="0" 0 0
FFT_NPts="8192" 0 0
FFT_IncludeDCHarmonic=True 0 0
FFT_AutoScale_Harmonics="10" 0 0
MonMaxShow=6 0 0 0 0
MonPageWidth=66 0 0 0 0
MonPlotWidth=21 0 0 0 0
MonExprXWidth=140 0 0 0 0
MonExprYWidth=256 0 0 0 0
MonRangeXWidth=90 0 0 0 0
MonRangeYWidth=90 0 0 0 0
Save_For_Future=No 0 0 0 0
Reduce_Display=1 0 0
Reduce_Save=1 0 0
Reduce_ThrowDataOut=0 0 0
Wave Format=16E 0
State Variables Format=5E 0 0
SELECT=No 0 0 0 0
GRAPHIC=No 0 0 0 0
LINE=No 0 0
ELLIPSE=No 0 0 0 0
RECT=No 0 0
DIAM=No 0 0
LEFTBRK=No 0 0
RIGHTBRK=No 0 0
META=No 0 0 0 0
SCALE=No 0 0 0 0
CURSOR=No 0 0
MEASUREH=No 0 0 0 0
MEASUREV=No 0 0 0 0
TAG=No 0 0 0 0
TEXT=No 0 0 0 0
START=No 0 0 0 0
STOP=No 0 0 0 0
RESUME=No 0 0
DATAPTS=No 0 0
TOKENS=No 0 0 0 0
RULER=No 0 0
MINORLOG=No 0 0 0 0
LOG25=No 0 0
HORIZCUR=No 0 0
GOTOX=No 0 0 0 0
GOTOY=No 0 0 0 0
GOTOPERF=No 0 0 0 0
GOTOBRNC=No 0 0 0 0
CLEAR_ACCUMULATED=No 0 0
VALLEY=No 0 0
HIGH=No 0 0
LOW=No 0 0
INFLECTN=No 0 0
GHIGH=No 0 0 0 0
GLOW=No 0 0 0 0
TOP=No 0 0 0 0
WAVEFORMBUFFER=No 0 0
ENXSCALE=No 0 0 0 0
ENYSCALE=No 0 0 0 0
* ZOOMIN=No: mesfet (symbol mesfet not available, pin order unknown); nets seen at it: 0
* ZOOMOUT=No: mesfet (symbol mesfet not available, pin order unknown); nets seen at it: 0
RESTORESCALE=No 0 0
COLOR=No 0 0
FONT=No 0 0
SELNEXT=No 0 0 0 0
CURSORTOCLIPBOARD=No 0 0
TRACKER_CURSOR=No 0 0 0 0
TRACKER_CURSOR_BRANCHINFO=No 0 0 0 0
TRACKER_INTERCEPT=No 0 0 0 0
TRACKER_MOUSE=No 0 0 0 0
TOFRONT=No 0 0 0 0
TOBACK=No 0 0 0 0
SPLITCIRTEXTH=No 0 0 0 0
SPLITCIRTEXTV=No 0 0 0 0
SPACE_SPLITTERS_EVENLY=No 0 0 0 0
LABEL_WAVEFORM=No 0 0
LABEL_DATA_POINTS=No 0 0
WFB_ADD_TO_LIMITS=No 0 0
ENVELOPE=No 0 0 0 0
SAMEYSCALES=No 0 0 0 0
SHOWWATCH=No 0 0 0 0
TOGGLEMODE=No 0 0 0 0
REMOVEALLTEXT=No 0 0
LABELALLMINOR=No 0 0
Window Placement=0,1, -1,-1, -4,-27, 793,0,1586,958
Font=Height=-15,FStyle=0,Color=#0000FF,Name=Arial 0 0
WinBackGround Color=#FFFFFF 0
Select Color=#FF0000 0 0 0
Select Box Color=#000080 0 0
Title=DIST_DEMO1.CIR VIN=50m...200m 0 F2=14KHz 0
Grid Color=#808080 0 0 0
Grid Weight=1 0 0 0
Grid Pattern=Dot6 0 0 0
Tracker Foreground=Height=-15,FStyle=0,Color=#000000,Name=Arial 0 0 0
Tracker Background=#FFFF00 0 0 0
Static Grids=False 0 0 0
MinorLog25=Off 0 0 0 0
LabelMinor=Off 0 0
DataPoints=False 0 0
Token=False 0 0 0 0
Ruler=False 0 0
MinorLogGrids=False 0 0 0 0
TagFormatX=3 0 0 0 0
TagFormatY=3 0 0 0 0
FormulaFormat=3 0 0
Graph Background=#FFFFFF 0 0 0
Tracker Intercept=False 0 0 0
Tracker Mouse=True 0 0 0
Tracker Cursor=True 0 0 0
Tracker Cursor 0 BranchInfo=False 0
Horizontal Cursor=False 0
Same Y Scales=Yes 0 0
Enable X Scaling=True 0 0
Enable Y Scaling=True 0 0
Cursor Select Color Primary=#C0C0C0
Cursor Select Color Secondary=#FF0000
Data Point Labels Color Fore=Height=-15,FStyle=0,Color=#000000,Name=Arial
Data Point Labels Color Back=#FFFF00
OperPoint=True 0 0 0 0
DoPSS=True 0 0
FFT_Min="0" 0 0
FFT_NPts="8192" 0 0
FFT_IncludeDCHarmonic=False 0 0
FFT_AutoScale_Harmonics="10" 0 0
MonMaxShow=4 0 0 0 0
MonPageWidth=66 0 0 0 0
MonPlotWidth=21 0 0 0 0
MonExprXWidth=142 0 0 0 0
MonExprYWidth=260 0 0 0 0
MonRangeXWidth=90 0 0 0 0
MonRangeYWidth=90 0 0 0 0
Save_For_Future=No 0 0 0 0
Reduce_Display=1 0 0
Reduce_Save=1 0 0
Reduce_ThrowDataOut=0 0 0
Wave Format=16E 0
State Variables Format=5E 0 0
SELECT=Yes 0 0 0 0
GRAPHIC=Yes 0 0 0 0
LINE=No 0 0
ELLIPSE=No 0 0 0 0
RECT=No 0 0
DIAM=No 0 0
LEFTBRK=No 0 0
RIGHTBRK=No 0 0
META=No 0 0 0 0
SCALE=Yes 0 0 0 0
CURSOR=Yes 0 0
MEASUREH=Yes 0 0 0 0
MEASUREV=Yes 0 0 0 0
TAG=Yes 0 0 0 0
TEXT=Yes 0 0 0 0
START=Yes 0 0 0 0
STOP=Yes 0 0 0 0
RESUME=No 0 0
DATAPTS=Yes 0 0
TOKENS=Yes 0 0 0 0
RULER=No 0 0
MINORLOG=Yes 0 0 0 0
LOG25=No 0 0
HORIZCUR=No 0 0
GOTOX=Yes 0 0 0 0
GOTOY=Yes 0 0 0 0
GOTOPERF=Yes 0 0 0 0
GOTOBRNC=Yes 0 0 0 0
CLEAR_ACCUMULATED=Yes 0 0
VALLEY=Yes 0 0
HIGH=Yes 0 0
LOW=Yes 0 0
INFLECTN=Yes 0 0
GHIGH=Yes 0 0 0 0
GLOW=Yes 0 0 0 0
TOP=Yes 0 0 0 0
WAVEFORMBUFFER=Yes 0 0
ENXSCALE=Yes 0 0 0 0
ENYSCALE=Yes 0 0 0 0
* ZOOMIN=Yes: mesfet (symbol mesfet not available, pin order unknown); nets seen at it: 0
* ZOOMOUT=Yes: mesfet (symbol mesfet not available, pin order unknown); nets seen at it: 0
RESTORESCALE=No 0 0
COLOR=No 0 0
FONT=No 0 0
SELNEXT=No 0 0 0 0
CURSORTOCLIPBOARD=No 0 0
TRACKER_CURSOR=No 0 0 0 0
TRACKER_CURSOR_BRANCHINFO=No 0 0 0 0
TRACKER_INTERCEPT=No 0 0 0 0
TRACKER_MOUSE=No 0 0 0 0
TOFRONT=No 0 0 0 0
TOBACK=No 0 0 0 0
SPLITCIRTEXTH=No 0 0 0 0
SPLITCIRTEXTV=No 0 0 0 0
SPACE_SPLITTERS_EVENLY=No 0 0 0 0
LABEL_WAVEFORM=No 0 0
LABEL_DATA_POINTS=No 0 0
WFB_ADD_TO_LIMITS=No 0 0
ENVELOPE=No 0 0 0 0
SAMEYSCALES=No 0 0 0 0
SHOWWATCH=No 0 0 0 0
TOGGLEMODE=No 0 0 0 0
REMOVEALLTEXT=No 0 0
LABELALLMINOR=No 0 0
Status=Off 0 0 0 0
* Zero: mesfet (symbol mesfet not available, pin order unknown); nets seen at it: 0, Tolerance=False
Eliminate Outliers=False 0 0 0
Distribution=Normal 0 0
Seed=0 0 0 0 0
Status=Off 0 0 0 0
* Zero: mesfet (symbol mesfet not available, pin order unknown); nets seen at it: 0, Tolerance=False
Eliminate Outliers=False 0 0 0
Distribution=Normal 0 0
Seed=0 0 0 0 0
Status=Off 0 0 0 0
* Zero: mesfet (symbol mesfet not available, pin order unknown); nets seen at it: 0, Tolerance=False
Eliminate Outliers=False 0 0 0
Distribution=Normal 0 0
Seed=0 0 0 0 0
Status=Off 0 0 0 0
* Zero: mesfet (symbol mesfet not available, pin order unknown); nets seen at it: 0, Tolerance=False
Eliminate Outliers=False 0 0 0
Distribution=Normal 0 0
Seed=0 0 0 0 0
Status=Off 0 0 0 0
* Zero: mesfet (symbol mesfet not available, pin order unknown); nets seen at it: 0, Tolerance=False
Eliminate Outliers=False 0 0 0
Distribution=Normal 0 0
Seed=0 0 0 0 0
Window Placement=1,2, 320,930, -4,-27, 0,0,793,930
Font=Height=-18,FStyle=0,Color=#0000FF,Name=Comic Sans MS
WinBackGround Color=#FFFFFF 0
Select Color=#FF0000 0 0 0
Select Box Color=#000080 0 0
Title=H1 vs : POUT F = 1K...50K,H2 vs POUT : F = 1K...50K,H3 vs POUT : F = 1K...50K
ShowWin=True 0 0 0 0
Grid Color=#808080 0 0 0
Grid Weight=1 0 0 0
Grid Pattern=Dot6 0 0 0
Tracker Foreground=Height=-15,FStyle=0,Color=#000000,Name=Arial 0 0 0
Tracker Background=#FFFF00 0 0 0
Static Grids=False 0 0 0
Label Color Background=#FFFFFF
MinorLog25=Off 0 0 0 0
LabelMinor=Off 0 0
DataPoints=True 0 0
Token=False 0 0 0 0
Ruler=False 0 0
MinorLogGrids=False 0 0 0 0
TagFormatX=3 0 0 0 0
TagFormatY=3 0 0 0 0
FormulaFormat=3 0 0
Graph Background=#FFFFFF 0 0 0
Tracker Intercept=False 0 0 0
Tracker Mouse=True 0 0 0
Tracker Cursor=True 0 0 0
Horizontal Cursor=False 0
Same Y Scales=Yes 0 0
Enable X Scaling=True 0 0
Enable Y Scaling=True 0 0
SELECT=Yes 0 0 0 0
GRAPHIC=Yes 0 0 0 0
LINE=No 0 0
ELLIPSE=No 0 0 0 0
RECT=No 0 0
DIAM=No 0 0
LEFTBRK=No 0 0
RIGHTBRK=No 0 0
META=No 0 0 0 0
SCALE=Yes 0 0 0 0
CURSOR=Yes 0 0
MEASUREH=Yes 0 0 0 0
MEASUREV=Yes 0 0 0 0
TAG=Yes 0 0 0 0
TEXT=Yes 0 0 0 0
DATAPTS=Yes 0 0
TOKENS=Yes 0 0 0 0
RULER=Yes 0 0
MINORLOG=Yes 0 0 0 0
LOG25=Yes 0 0
HORIZCUR=Yes 0 0
GOTOX=Yes 0 0 0 0
GOTOY=Yes 0 0 0 0
GOTOPERF=Yes 0 0 0 0
GOTOBRNC=Yes 0 0 0 0
VALLEY=Yes 0 0
HIGH=Yes 0 0
LOW=Yes 0 0
INFLECTN=Yes 0 0
GHIGH=Yes 0 0 0 0
GLOW=Yes 0 0 0 0
ENXSCALE=Yes 0 0 0 0
ENYSCALE=Yes 0 0 0 0
* ZOOMIN=Yes: mesfet (symbol mesfet not available, pin order unknown); nets seen at it: 0
* ZOOMOUT=Yes: mesfet (symbol mesfet not available, pin order unknown); nets seen at it: 0
RESTORESCALE=No 0 0
COLOR=Yes 0 0
FONT=Yes 0 0
SELNEXT=No 0 0 0 0
CURSORTOCLIPBOARD=No 0 0
TRACKER_CURSOR=No 0 0 0 0
TRACKER_CURSOR_BRANCHINFO=No 0 0 0 0
TRACKER_INTERCEPT=No 0 0 0 0
TRACKER_MOUSE=No 0 0 0 0
TOFRONT=Yes 0 0 0 0
TOBACK=Yes 0 0 0 0
SPLITCIRTEXTH=No 0 0 0 0
SPLITCIRTEXTV=No 0 0 0 0
SPACE_SPLITTERS_EVENLY=No 0 0 0 0
LABEL_WAVEFORM=No 0 0
LABEL_DATA_POINTS=No 0 0
SAMEYSCALES=No 0 0 0 0
TOGGLEMODE=No 0 0 0 0
REMOVEALLTEXT=No 0 0
LABELALLMINOR=No 0 0
Object=Text 0 0 0 0
CFill=#FFFFFF 0 0
CBorder=None 0 0
w=0 0 0
Font=Height=-15,FStyle=0,Color=#0000FF,Name=Arial 0 0
Text="F = 0 1K" 0
LabelWaveform=True 0 0
Object=Text 0 0 0 0
CFill=#FFFFFF 0 0
CBorder=None 0 0
w=0 0 0
Font=Height=-15,FStyle=0,Color=#0000FF,Name=Arial 0 0
Text="F = 0 50K" 0
LabelWaveform=True 0 0
Object=Text 0 0 0 0
CFill=#FFFFFF 0 0
CBorder=None 0 0
w=1 0 0
Font=Height=-15,FStyle=0,Color=#FF0000,Name=Arial 0 0
Text="F = 0 1K" 0
LabelWaveform=True 0 0
Object=Text 0 0 0 0
CFill=#FFFFFF 0 0
CBorder=None 0 0
w=1 0 0
Font=Height=-15,FStyle=0,Color=#FF0000,Name=Arial 0 0
Text="F = 0 50K" 0
LabelWaveform=True 0 0
Object=Text 0 0 0 0
CFill=#FFFFFF 0 0
CBorder=None 0 0
w=2 0 0
Font=Height=-15,FStyle=0,Color=#008000,Name=Arial 0 0
Text="F = 0 1K" 0
LabelWaveform=True 0 0
Object=Text 0 0 0 0
CFill=#FFFFFF 0 0
CBorder=None 0 0
w=2 0 0
Font=Height=-15,FStyle=0,Color=#008000,Name=Arial 0 0
Text="F = 0 50K" 0
LabelWaveform=True 0 0
Designator=Simple 0 0
WhatToPlotY=H1P (dB) 0
WhatToPlot=POUT (dB) 0
SteppingCase 20=All 0 0 0
VFmtX=3 0 0
VFmtY=3 0 0
ScaleFactorX="None" 0 0 0 0
ScaleFactorY="None" 0 0 0 0
ScaleUnitsX="Auto" 0 0 0 0
ScaleUnitsY="Auto" 0 0 0 0
SFmtX=3 0 0 0 0
SFmtY=3 0 0 0 0
DPS=Open Bubbles 0
CS=Normal 0 0
Line Color=#0000FF 0
Text Color=#0000FF 0 0 0
Rainbow=False 0 0
LWdth=3 0 0
Enable=0 0 0 0 0
Range Min X=-45
Range Min Y=-225
Range Max X=30
Range Max Y=150
Range Grid X=15
Range Grid Y=75
Range Bold X=0
Range Bold Y=0
LinearX=True 0 0
LinearY=True 0 0
Show Labels=True 0 0 0
Labels Default Font=Height=-15,FStyle=0,Color=#0000FF,Name=Arial
Designator=Simple 0 0
WhatToPlotY=H2P (dB) 0
WhatToPlot=POUT (dB) 0
SteppingCase 20=All 0 0 0
VFmtX=3 0 0
VFmtY=3 0 0
ScaleFactorX="None" 0 0 0 0
ScaleFactorY="None" 0 0 0 0
ScaleUnitsX="Auto" 0 0 0 0
ScaleUnitsY="Auto" 0 0 0 0
SFmtX=3 0 0 0 0
SFmtY=3 0 0 0 0
DPS=Open Bubbles 0
CS=Normal 0 0
Line Color=#FF0000 0
Text Color=#FF0000 0 0 0
Rainbow=False 0 0
LWdth=3 0 0
Enable=0 0 0 0 0
Range Min X=-45
Range Min Y=-225
Range Max X=30
Range Max Y=150
Range Grid X=15
Range Grid Y=75
Range Bold X=0
Range Bold Y=0
LinearX=True 0 0
LinearY=True 0 0
Show Labels=True 0 0 0
Labels Default Font=Height=-15,FStyle=0,Color=#0000FF,Name=Arial
Designator=Simple 0 0
WhatToPlotY=H3P (dB) 0
WhatToPlot=POUT (dB) 0
SteppingCase 20=All 0 0 0
VFmtX=3 0 0
VFmtY=3 0 0
ScaleFactorX="None" 0 0 0 0
ScaleFactorY="None" 0 0 0 0
ScaleUnitsX="Auto" 0 0 0 0
ScaleUnitsY="Auto" 0 0 0 0
SFmtX=3 0 0 0 0
SFmtY=3 0 0 0 0
DPS=Open Bubbles 0
CS=Normal 0 0
Line Color=#008000 0
Text Color=#008000 0 0 0
Rainbow=False 0 0
LWdth=3 0 0
Enable=0 0 0 0 0
Range Min X=-45
Range Min Y=-225
Range Max X=30
Range Max Y=150
Range Grid X=15
Range Grid Y=75
Range Bold X=0
Range Bold Y=0
LinearX=True 0 0
LinearY=True 0 0
Show Labels=True 0 0 0
Labels Default Font=Height=-15,FStyle=0,Color=#0000FF,Name=Arial
VIN (dB)=0 0
Show=True 0 0 0 0
ScaleUnits="Auto" 0 0 0 0
VIN=1 0 0
Show=True 0 0 0 0
ScaleUnits="Auto" 0 0 0 0
VOUT (dB)=2 0
Show=True 0 0 0 0
ScaleUnits="Auto" 0 0 0 0
VOUT=3 0 0
Show=True 0 0 0 0
ScaleUnits="Auto" 0 0 0 0
Show=True 0 0 0 0
ScaleUnits="Auto" 0 0 0 0
Show=True 0 0 0 0
ScaleUnits="Auto" 0 0 0 0
Show=True 0 0 0 0
ScaleUnits="Auto" 0 0 0 0
Show=True 0 0 0 0
ScaleUnits="Auto" 0 0 0 0
Show=False 0 0 0 0
ScaleUnits="Auto" 0 0 0 0
Show=False 0 0 0 0
ScaleUnits="Auto" 0 0 0 0
F=10 0 0
Show=True 0 0 0 0
ScaleUnits="Auto" 0 0 0 0
VIN_RMS (dB)=11 0
Show=False 0 0 0 0
ScaleUnits="Auto" 0 0 0 0
VIN_RMS=12 0 0
Show=True 0 0 0 0
ScaleUnits="Auto" 0 0 0 0
VOUT_RMS (dB)=13 0
Show=False 0 0 0 0
ScaleUnits="Auto" 0 0 0 0
VOUT_RMS=14 0 0
Show=True 0 0 0 0
ScaleUnits="Auto" 0 0 0 0
Show=False 0 0 0 0
ScaleUnits="Auto" 0 0 0 0
Show=False 0 0 0 0
ScaleUnits="Auto" 0 0 0 0
Show=True 0 0 0 0
ScaleUnits="Auto" 0 0 0 0
Show=False 0 0 0 0
ScaleUnits="Auto" 0 0 0 0
Show=False 0 0 0 0
ScaleUnits="Auto" 0 0 0 0
Show=True 0 0 0 0
ScaleUnits="Auto" 0 0 0 0
H1V (%)=21 0
Show=False 0 0 0 0
ScaleUnits="Auto" 0 0 0 0
H1V (dB)=22 0
Show=False 0 0 0 0
ScaleUnits="Auto" 0 0 0 0
H1V=23 0 0
Show=True 0 0 0 0
ScaleUnits="Auto" 0 0 0 0
H1P (%)=24 0
Show=False 0 0 0 0
ScaleUnits="Auto" 0 0 0 0
H1P (dB)=25 0
Show=False 0 0 0 0
ScaleUnits="Auto" 0 0 0 0
H1P (dBm)=26 0
Show=False 0 0 0 0
ScaleUnits="Auto" 0 0 0 0
H1P=27 0 0
Show=False 0 0 0 0
ScaleUnits="Auto" 0 0 0 0
H2V (%)=28 0
Show=False 0 0 0 0
ScaleUnits="Auto" 0 0 0 0
H2V (dB)=29 0
Show=False 0 0 0 0
ScaleUnits="Auto" 0 0 0 0
H2V=30 0 0
Show=True 0 0 0 0
ScaleUnits="Auto" 0 0 0 0
H2P (%)=31 0
Show=False 0 0 0 0
ScaleUnits="Auto" 0 0 0 0
H2P (dB)=32 0
Show=False 0 0 0 0
ScaleUnits="Auto" 0 0 0 0
H2P (dBm)=33 0
Show=False 0 0 0 0
ScaleUnits="Auto" 0 0 0 0
H2P=34 0 0
Show=False 0 0 0 0
ScaleUnits="Auto" 0 0 0 0
H3V (%)=35 0
Show=False 0 0 0 0
ScaleUnits="Auto" 0 0 0 0
H3V (dB)=36 0
Show=False 0 0 0 0
ScaleUnits="Auto" 0 0 0 0
H3V=37 0 0
Show=True 0 0 0 0
ScaleUnits="Auto" 0 0 0 0
H3P (%)=38 0
Show=False 0 0 0 0
ScaleUnits="Auto" 0 0 0 0
H3P (dB)=39 0
Show=False 0 0 0 0
ScaleUnits="Auto" 0 0 0 0
H3P (dBm)=40 0
Show=False 0 0 0 0
ScaleUnits="Auto" 0 0 0 0
H3P=41 0 0
Show=False 0 0 0 0
ScaleUnits="Auto" 0 0 0 0
H4V (%)=42 0
Show=False 0 0 0 0
ScaleUnits="Auto" 0 0 0 0
H4V (dB)=43 0
Show=False 0 0 0 0
ScaleUnits="Auto" 0 0 0 0
H4V=44 0 0
Show=False 0 0 0 0
ScaleUnits="Auto" 0 0 0 0
H4P (%)=45 0
Show=False 0 0 0 0
ScaleUnits="Auto" 0 0 0 0
H4P (dB)=46 0
Show=False 0 0 0 0
ScaleUnits="Auto" 0 0 0 0
H4P (dBm)=47 0
Show=False 0 0 0 0
ScaleUnits="Auto" 0 0 0 0
H4P=48 0 0
Show=False 0 0 0 0
ScaleUnits="Auto" 0 0 0 0
H5V (%)=49 0
Show=False 0 0 0 0
ScaleUnits="Auto" 0 0 0 0
H5V (dB)=50 0
Show=False 0 0 0 0
ScaleUnits="Auto" 0 0 0 0
H5V=51 0 0
Show=False 0 0 0 0
ScaleUnits="Auto" 0 0 0 0
H5P (%)=52 0
Show=False 0 0 0 0
ScaleUnits="Auto" 0 0 0 0
H5P (dB)=53 0
Show=False 0 0 0 0
ScaleUnits="Auto" 0 0 0 0
H5P (dBm)=54 0
Show=False 0 0 0 0
ScaleUnits="Auto" 0 0 0 0
H5P=55 0 0
Show=False 0 0 0 0
ScaleUnits="Auto" 0 0 0 0
H6V (%)=56 0
Show=False 0 0 0 0
ScaleUnits="Auto" 0 0 0 0
H6V (dB)=57 0
Show=False 0 0 0 0
ScaleUnits="Auto" 0 0 0 0
H6V=58 0 0
Show=False 0 0 0 0
ScaleUnits="Auto" 0 0 0 0
H6P (%)=59 0
Show=False 0 0 0 0
ScaleUnits="Auto" 0 0 0 0
H6P (dB)=60 0
Show=False 0 0 0 0
ScaleUnits="Auto" 0 0 0 0
H6P (dBm)=61 0
Show=False 0 0 0 0
ScaleUnits="Auto" 0 0 0 0
H6P=62 0 0
Show=False 0 0 0 0
ScaleUnits="Auto" 0 0 0 0
H7V (%)=63 0
Show=False 0 0 0 0
ScaleUnits="Auto" 0 0 0 0
H7V (dB)=64 0
Show=False 0 0 0 0
ScaleUnits="Auto" 0 0 0 0
H7V=65 0 0
Show=False 0 0 0 0
ScaleUnits="Auto" 0 0 0 0
H7P (%)=66 0
Show=False 0 0 0 0
ScaleUnits="Auto" 0 0 0 0
H7P (dB)=67 0
Show=False 0 0 0 0
ScaleUnits="Auto" 0 0 0 0
H7P (dBm)=68 0
Show=False 0 0 0 0
ScaleUnits="Auto" 0 0 0 0
H7P=69 0 0
Show=False 0 0 0 0
ScaleUnits="Auto" 0 0 0 0
H8V (%)=70 0
Show=False 0 0 0 0
ScaleUnits="Auto" 0 0 0 0
H8V (dB)=71 0
Show=False 0 0 0 0
ScaleUnits="Auto" 0 0 0 0
H8V=72 0 0
Show=False 0 0 0 0
ScaleUnits="Auto" 0 0 0 0
H8P (%)=73 0
Show=False 0 0 0 0
ScaleUnits="Auto" 0 0 0 0
H8P (dB)=74 0
Show=False 0 0 0 0
ScaleUnits="Auto" 0 0 0 0
H8P (dBm)=75 0
Show=False 0 0 0 0
ScaleUnits="Auto" 0 0 0 0
H8P=76 0 0
Show=False 0 0 0 0
ScaleUnits="Auto" 0 0 0 0
H9V (%)=77 0
Show=False 0 0 0 0
ScaleUnits="Auto" 0 0 0 0
H9V (dB)=78 0
Show=False 0 0 0 0
ScaleUnits="Auto" 0 0 0 0
H9V=79 0 0
Show=False 0 0 0 0
ScaleUnits="Auto" 0 0 0 0
H9P (%)=80 0
Show=False 0 0 0 0
ScaleUnits="Auto" 0 0 0 0
H9P (dB)=81 0
Show=False 0 0 0 0
ScaleUnits="Auto" 0 0 0 0
H9P (dBm)=82 0
Show=False 0 0 0 0
ScaleUnits="Auto" 0 0 0 0
H9P=83 0 0
Show=False 0 0 0 0
ScaleUnits="Auto" 0 0 0 0
H3_RMSP (%)=84 0
Show=False 0 0 0 0
ScaleUnits="Auto" 0 0 0 0
H3_RMSP (dB)=85 0
Show=False 0 0 0 0
ScaleUnits="Auto" 0 0 0 0
H3_RMSP (dBm)=86 0
Show=False 0 0 0 0
ScaleUnits="Auto" 0 0 0 0
H3_RMSP=87 0 0
Show=False 0 0 0 0
ScaleUnits="Auto" 0 0 0 0
H4_RMSV (%)=88 0
Show=False 0 0 0 0
ScaleUnits="Auto" 0 0 0 0
H4_RMSV (dB)=89 0
Show=False 0 0 0 0
ScaleUnits="Auto" 0 0 0 0
H4_RMSV=90 0 0
Show=False 0 0 0 0
ScaleUnits="Auto" 0 0 0 0
H4_RMSP (%)=91 0
Show=False 0 0 0 0
ScaleUnits="Auto" 0 0 0 0
H4_RMSP (dB)=92 0
Show=False 0 0 0 0
ScaleUnits="Auto" 0 0 0 0
H4_RMSP (dBm)=93 0
Show=False 0 0 0 0
ScaleUnits="Auto" 0 0 0 0
H4_RMSP=94 0 0
Show=False 0 0 0 0
ScaleUnits="Auto" 0 0 0 0
H5_RMSV (%)=95 0
Show=False 0 0 0 0
ScaleUnits="Auto" 0 0 0 0
H5_RMSV (dB)=96 0
Show=False 0 0 0 0
ScaleUnits="Auto" 0 0 0 0
H5_RMSV=97 0 0
Show=False 0 0 0 0
ScaleUnits="Auto" 0 0 0 0
H5_RMSP (%)=98 0
Show=False 0 0 0 0
ScaleUnits="Auto" 0 0 0 0
H5_RMSP (dB)=99 0
Show=False 0 0 0 0
ScaleUnits="Auto" 0 0 0 0
H5_RMSP (dBm)=100 0
Show=False 0 0 0 0
ScaleUnits="Auto" 0 0 0 0
H5_RMSP=101 0 0